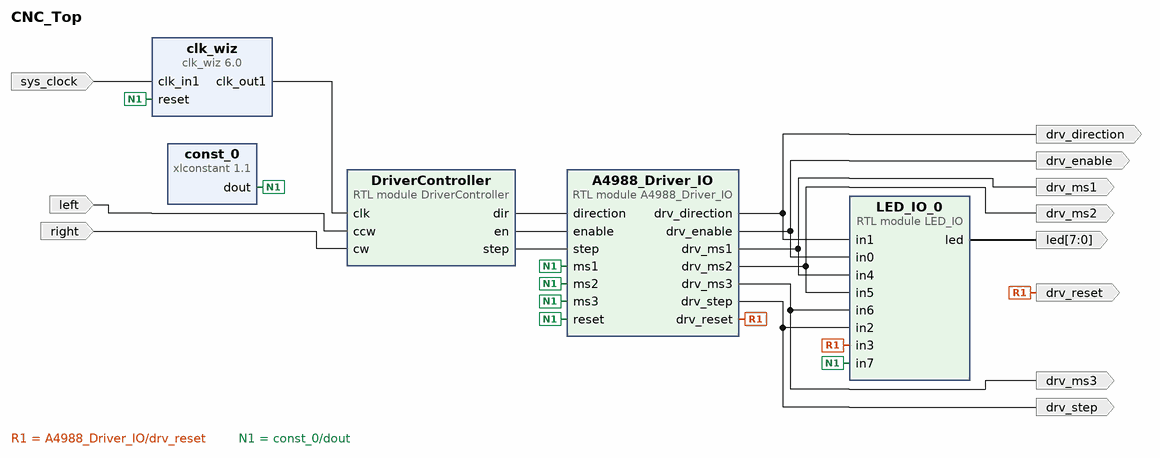
[diagram p0: block diagram of the top level]
# Vivado block design CNC_Top, xc7z020clg484-1, Vivado 2024.2
create_bd_design CNC_Top

create_bd_port -dir I -type clk sys_clock
set_property -dict {CONFIG.FREQ_HZ 100000000 CONFIG.PHASE 0.0} [get_bd_ports sys_clock]
create_bd_port -dir I right
create_bd_port -dir I left
create_bd_port -dir O drv_direction
create_bd_port -dir O drv_step
create_bd_port -dir O -type rst drv_reset
create_bd_port -dir O drv_ms1
create_bd_port -dir O drv_ms2
create_bd_port -dir O drv_ms3
create_bd_port -dir O drv_enable
create_bd_port -dir O -from 7 -to 0 led

create_bd_cell -type ip -vlnv xilinx.com:ip:clk_wiz:6.0 clk_wiz
set_property -dict [list \
  CONFIG.CLKOUT1_REQUESTED_OUT_FREQ 100.0 \
  CONFIG.CLK_IN1_BOARD_INTERFACE sys_clock \
  CONFIG.USE_BOARD_FLOW true \
] [get_bd_cells clk_wiz]
create_bd_cell -type ip -vlnv xilinx.com:ip:xlconstant:1.1 const_0
set_property -dict {CONFIG.CONST_VAL 0 CONFIG.CONST_WIDTH 1} [get_bd_cells const_0]
create_bd_cell -type module -reference A4988_Driver_IO A4988_Driver_IO
create_bd_cell -type module -reference DriverController DriverController
create_bd_cell -type module -reference LED_IO LED_IO_0

# ---- connections ----

connect_bd_net [get_bd_pins A4988_Driver_IO/drv_direction] [get_bd_ports drv_direction] [get_bd_pins LED_IO_0/in1]
connect_bd_net [get_bd_pins A4988_Driver_IO/drv_enable] [get_bd_ports drv_enable] [get_bd_pins LED_IO_0/in0]
connect_bd_net [get_bd_pins A4988_Driver_IO/drv_ms1] [get_bd_ports drv_ms1] [get_bd_pins LED_IO_0/in4]
connect_bd_net [get_bd_pins A4988_Driver_IO/drv_ms2] [get_bd_ports drv_ms2] [get_bd_pins LED_IO_0/in5]
connect_bd_net [get_bd_pins A4988_Driver_IO/drv_ms3] [get_bd_ports drv_ms3] [get_bd_pins LED_IO_0/in6]
connect_bd_net [get_bd_pins A4988_Driver_IO/drv_reset] [get_bd_ports drv_reset] [get_bd_pins LED_IO_0/in3]
connect_bd_net [get_bd_pins A4988_Driver_IO/drv_step] [get_bd_ports drv_step] [get_bd_pins LED_IO_0/in2]
connect_bd_net -net DriverController_0_dir [get_bd_pins DriverController/dir] [get_bd_pins A4988_Driver_IO/direction]
connect_bd_net -net DriverController_0_en [get_bd_pins DriverController/en] [get_bd_pins A4988_Driver_IO/enable]
connect_bd_net -net DriverController_0_step [get_bd_pins DriverController/step] [get_bd_pins A4988_Driver_IO/step]
connect_bd_net [get_bd_pins LED_IO_0/led] [get_bd_ports led]
connect_bd_net -net ccw_0_1 [get_bd_ports left] [get_bd_pins DriverController/ccw]
connect_bd_net [get_bd_pins clk_wiz/clk_out1] [get_bd_pins DriverController/clk]
connect_bd_net -net cw_0_1 [get_bd_ports right] [get_bd_pins DriverController/cw]
connect_bd_net [get_bd_ports sys_clock] [get_bd_pins clk_wiz/clk_in1]
connect_bd_net -net xlconstant_1_dout [get_bd_pins const_0/dout] \
  [get_bd_pins clk_wiz/reset] [get_bd_pins A4988_Driver_IO/reset] [get_bd_pins A4988_Driver_IO/ms1] \
  [get_bd_pins A4988_Driver_IO/ms2] [get_bd_pins A4988_Driver_IO/ms3] [get_bd_pins LED_IO_0/in7]

validate_bd_design
save_bd_design
